# Altium schematic sheet UBX_NORA_B1_SCHEM_0000_Topsheet.SchDoc
size A3; Date: 7/24/2020; CompanyName: U-Blox; DrawnBy: EMOO; Engineer: EMOO; Organization: U-Blox; Address1: 3950 Fairview Industrial Dr SE #100; Address2: Salem, OR 97302; SheetNumber: 0; SheetTotal: 6; SheetSize: B; SheetTitle: TopSheet
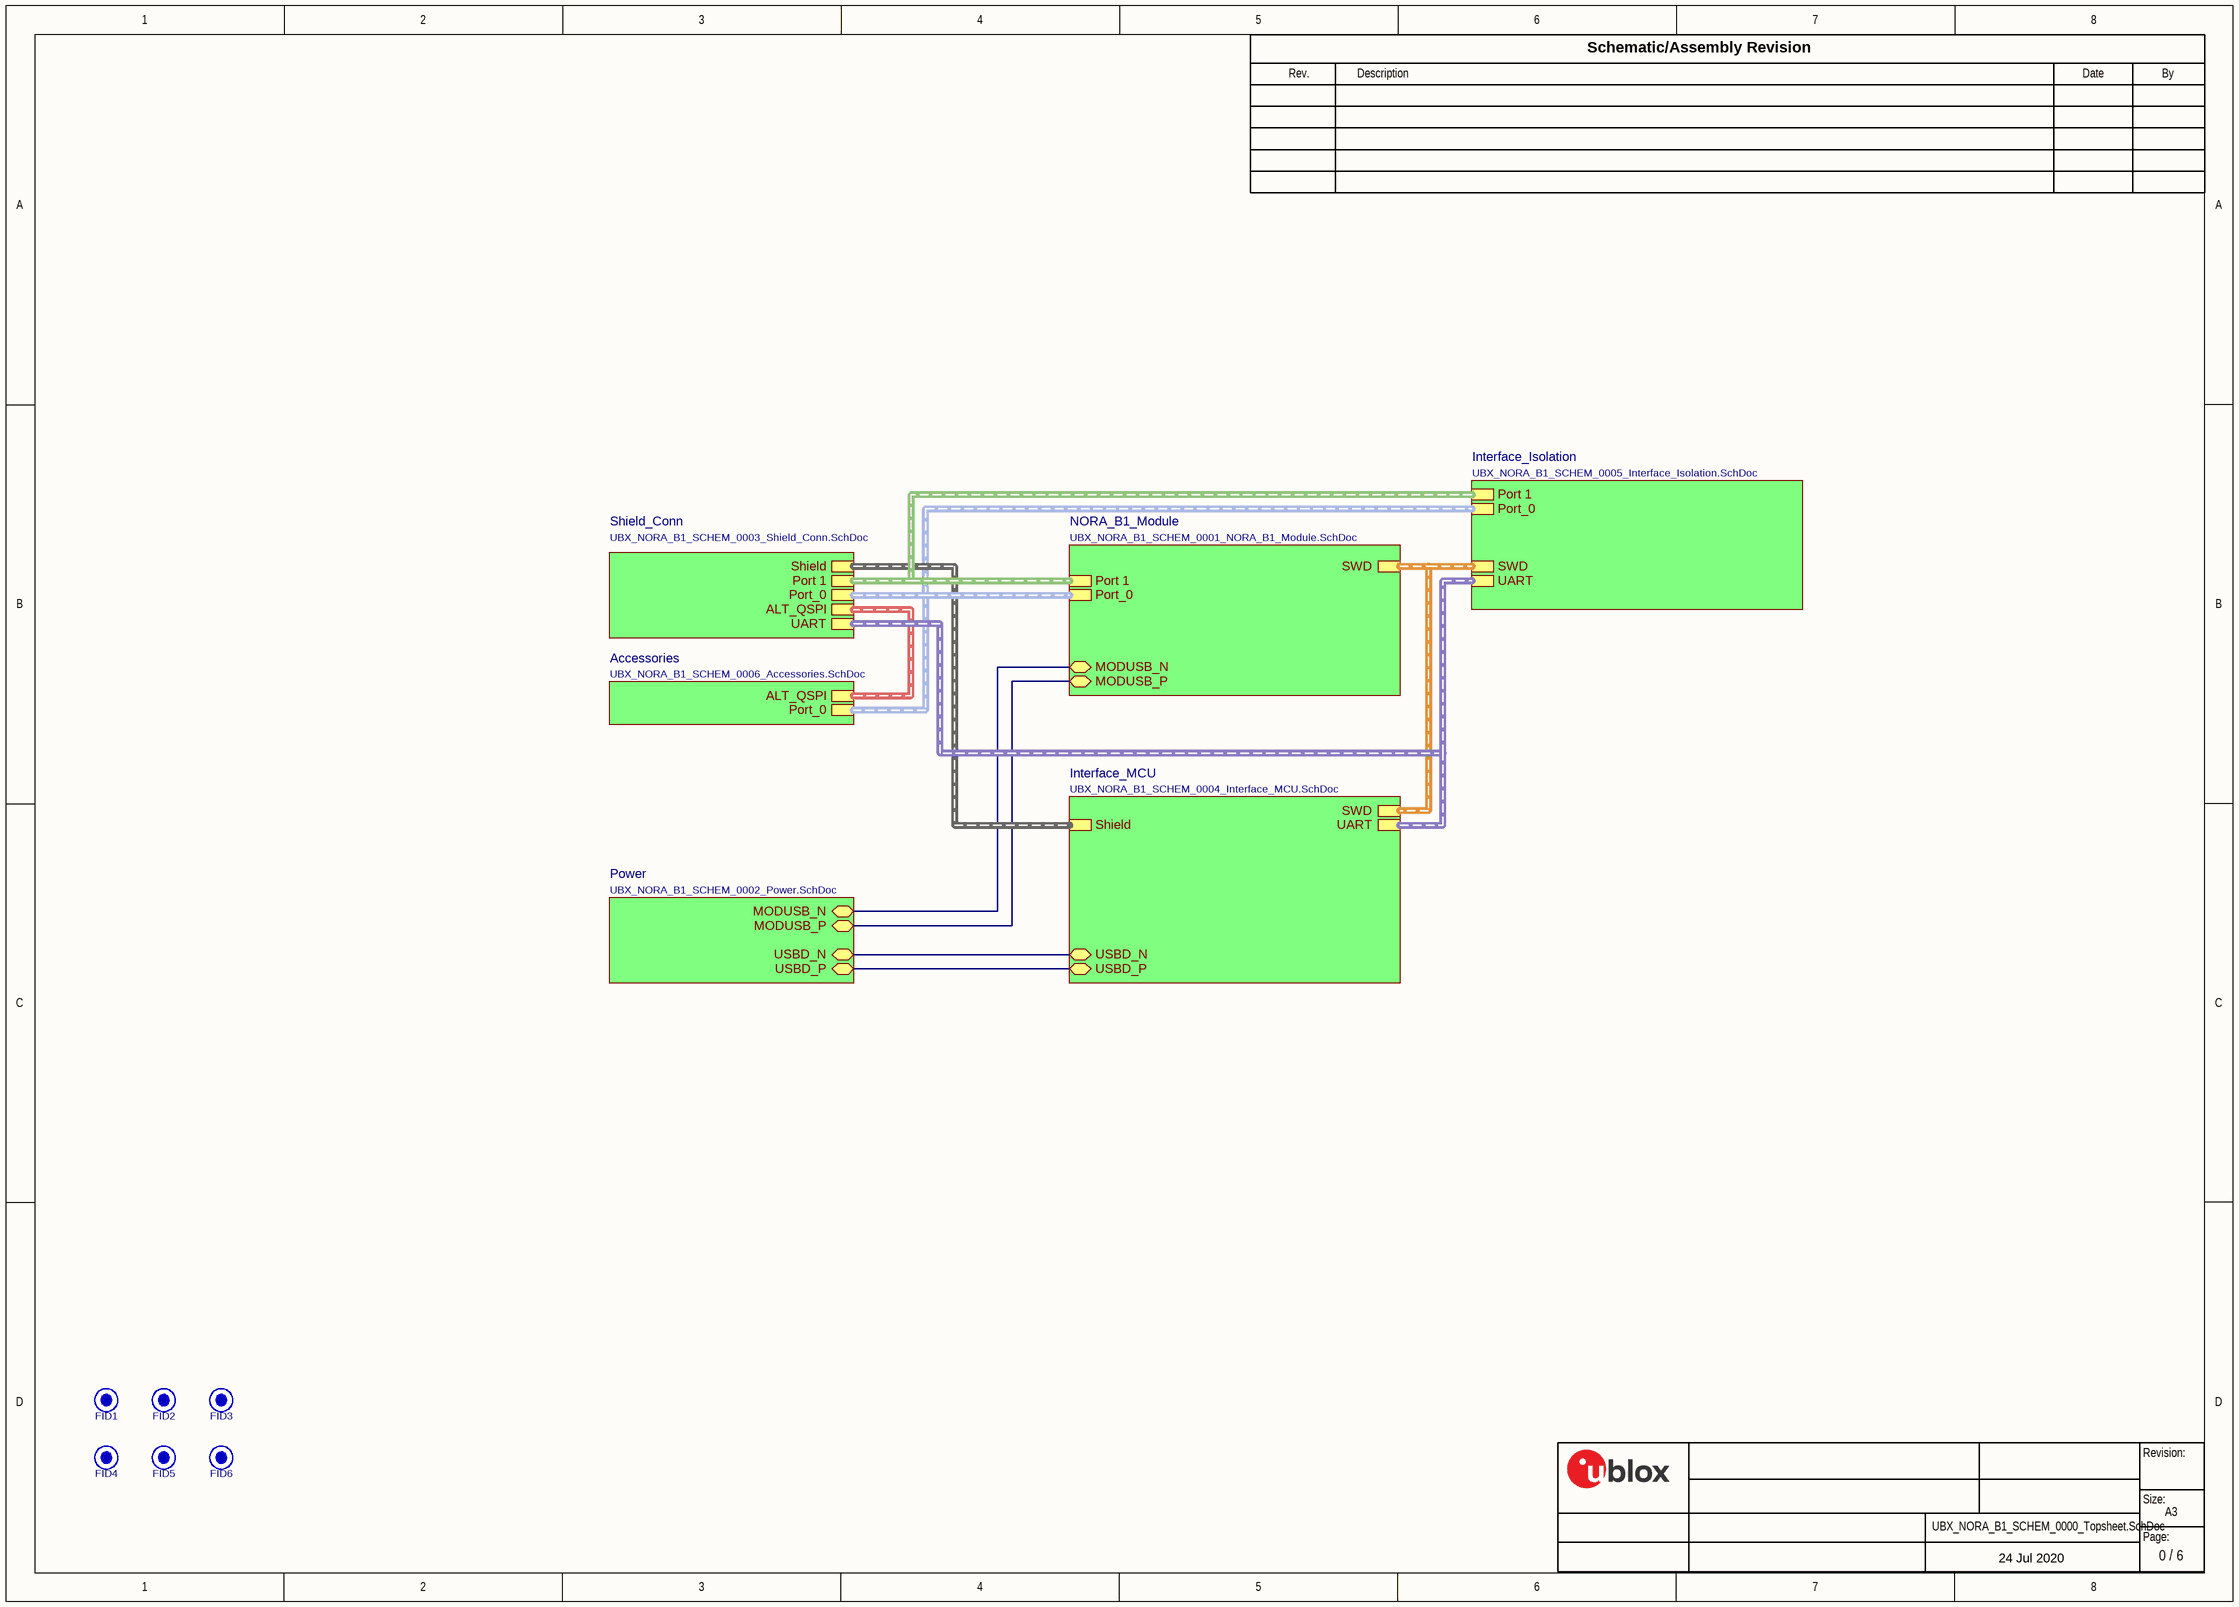
[diagram p0: UBX_NORA_B1_SCHEM_0000_Topsheet.SchDoc]

## Parts
FID1  FID  [FIDUCIAL40]  (value not drawn)
FID2  FID  [FIDUCIAL40]  (value not drawn)
FID3  FID  [FIDUCIAL40]  (value not drawn)
FID4  FID  [FIDUCIAL40]  (value not drawn)
FID5  FID  [FIDUCIAL40]  (value not drawn)
FID6  FID  [FIDUCIAL40]  (value not drawn)

## Sub-sheets
Accessories = UBX_NORA_B1_SCHEM_0006_Accessories.SchDoc: Port_0 (harness Port 0), ALT_QSPI (harness ALT_QSPI)
Interface_Isolation = UBX_NORA_B1_SCHEM_0005_Interface_Isolation.SchDoc: Port_0 (harness Port 0), SWD (harness SWD), UART (harness UART), Port 1 (harness Port 1)
Interface_MCU = UBX_NORA_B1_SCHEM_0004_Interface_MCU.SchDoc: SWD (harness SWD), USBD_N (bidir), USBD_P (bidir), UART (harness UART), Shield (harness Shield)
NORA_B1_Module = UBX_NORA_B1_SCHEM_0001_NORA_B1_Module.SchDoc: Port_0 (harness Port 0), Port 1 (harness Port 1), SWD (harness SWD), MODUSB_N (bidir), MODUSB_P (bidir)
Power = UBX_NORA_B1_SCHEM_0002_Power.SchDoc: USBD_N (bidir), MODUSB_P (bidir), MODUSB_N (bidir), USBD_P (bidir)
Shield_Conn = UBX_NORA_B1_SCHEM_0003_Shield_Conn.SchDoc: Port 1 (harness Port 1), Port_0 (harness Port 0), Shield (harness Shield), UART (harness UART), ALT_QSPI (harness ALT_QSPI)

## Nets
(unnamed): sheet NORA_B1_Module/MODUSB_N, sheet Power/MODUSB_N
(unnamed): sheet NORA_B1_Module/MODUSB_P, sheet Power/MODUSB_P
(unnamed): sheet Interface_MCU/USBD_N, sheet Power/USBD_N
(unnamed): sheet Interface_MCU/USBD_P, sheet Power/USBD_P

## Buses and harness runs
harness sheet Accessories/ALT_QSPI = sheet Shield_Conn/ALT_QSPI
harness sheet Accessories/Port_0 = sheet Interface_Isolation/Port_0 = sheet NORA_B1_Module/Port_0 = sheet Shield_Conn/Port_0
harness sheet Interface_Isolation/Port 1 = sheet NORA_B1_Module/Port 1 = sheet Shield_Conn/Port 1
harness sheet Interface_Isolation/SWD = sheet Interface_MCU/SWD = sheet NORA_B1_Module/SWD
harness sheet Interface_Isolation/UART = sheet Interface_MCU/UART = sheet Shield_Conn/UART
harness sheet Interface_MCU/Shield = sheet Shield_Conn/Shield

## Notes on the sheet
- 24 Jul 2020
- Rev.
- Description
- Schematic/Assembly Revision
- Date
- By
- Revision:
- Page:
- Size:
- A3

## Library data of the parts
FID1-FID6 = UBXH00-0000100: FIDUCIAL MARK 1MM DIA; Editor: eric.moog; Env: ROHS; Permitted Use: Volume Products; Perferred: PREF; Part Number: UBXH00-0000100; Min Operating Temp: -55°C; Max Operating Temp: 155°C; Part Type: Testpoint; UBX Wiki: https://wiki.u-blox.com/bin/view/Operations/PartDetails?index=38802; RefDes: TP